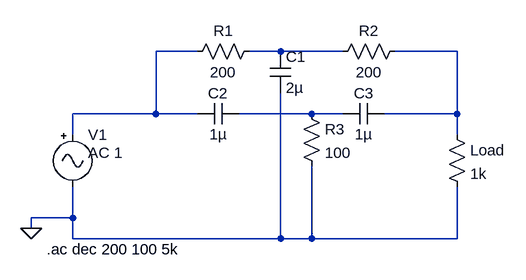
[diagram p0: schematic Twin-T_Band-stop_Filter.asc]
Twin-T_Band-stop_Filter.asc, the LTspice schematic file:
Version 4.1
SHEET 1 880 680
WIRE 256 0 192 0
WIRE 384 0 336 0
WIRE 480 0 384 0
WIRE 656 0 560 0
WIRE 192 96 192 0
WIRE 192 96 64 96
WIRE 256 96 192 96
WIRE 432 96 320 96
WIRE 480 96 432 96
WIRE 656 96 656 0
WIRE 656 96 544 96
WIRE 64 128 64 96
WIRE 656 128 656 96
WIRE 64 256 64 208
WIRE 64 256 0 256
WIRE 0 272 0 256
WIRE 64 288 64 256
WIRE 384 288 384 64
WIRE 384 288 64 288
WIRE 432 288 432 176
WIRE 432 288 384 288
WIRE 656 288 656 208
WIRE 656 288 432 288
FLAG 0 272 0
SYMBOL Misc\\signal 64 112 R0
WINDOW 3 24 44 Left 2
WINDOW 123 0 0 Left 0
WINDOW 39 0 0 Left 0
SYMATTR InstName V1
SYMATTR Value AC 1
SYMBOL res 640 112 R0
SYMATTR InstName Load
SYMATTR Value 1k
SYMBOL res 240 16 R270
WINDOW 0 32 56 VTop 2
WINDOW 3 0 56 VBottom 2
SYMATTR InstName R1
SYMATTR Value 200
SYMBOL res 464 16 R270
WINDOW 0 32 56 VTop 2
WINDOW 3 0 56 VBottom 2
SYMATTR InstName R2
SYMATTR Value 200
SYMBOL cap 368 0 R0
SYMATTR InstName C1
SYMATTR Value 2µ
SYMBOL cap 256 112 R270
WINDOW 0 32 32 VTop 2
WINDOW 3 0 32 VBottom 2
SYMATTR InstName C2
SYMATTR Value 1µ
SYMBOL res 416 80 R0
SYMATTR InstName R3
SYMATTR Value 100
SYMBOL cap 480 112 R270
WINDOW 0 32 32 VTop 2
WINDOW 3 0 32 VBottom 2
SYMATTR InstName C3
SYMATTR Value 1µ
TEXT 24 304 Left 2 !.ac dec 200 100 5k

The netlist it stands for:
* Twin-T_Band-stop_Filter.asc
V1 N001 0 AC 1
R§Load N003 0 1k
R1 N001 N002 200
R2 N002 N003 200
C1 N002 0 2µ
C2 N001 N004 1µ
R3 N004 0 100
C3 N004 N003 1µ
.ac dec 200 100 5k
.backanno
.end